# Altium schematic sheet ModRadio.SchDoc
size A
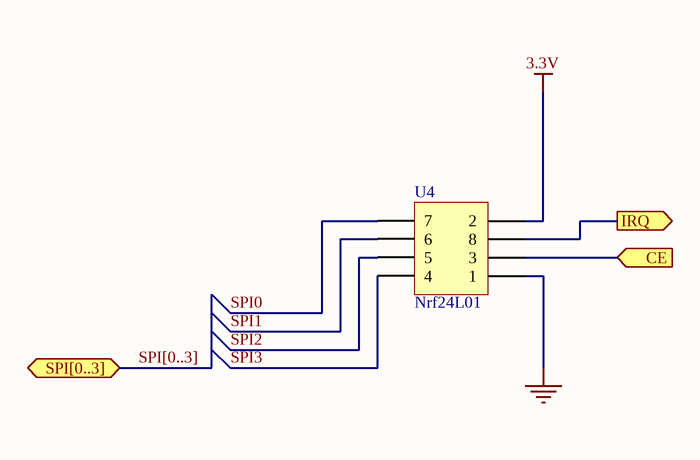
[diagram p0: ModRadio.SchDoc]

## Parts
U4  Nrf24L01  [NRF24L01]

## Ports
CE (in), IRQ (out), SPI[0..3] (bidir)

## Nets
3.3V: U4.2
GND: U4.1
CE: U4.3 ; port CE
IRQ: U4.8 ; port IRQ
SPI0: U4.7
SPI1: U4.6
SPI2: U4.5
SPI3: U4.4

## Buses and harness runs
bus SPI[0..3] = port SPI[0..3]

## Library data of the parts
U4 = Header 4X2: Header, 4-Pin, Dual row; Manufacturer: /; LatestRevisionDate: 17-Jul-2002; LatestRevisionNote: Re-released for DXP Platform.; Publisher: Altium Limited; Ref.Farnell: /; Ref.Manufacturer: /; Supplier: /